# EAGLE design EIB_RHD32_HW01 (EAGLE 9.0.0)
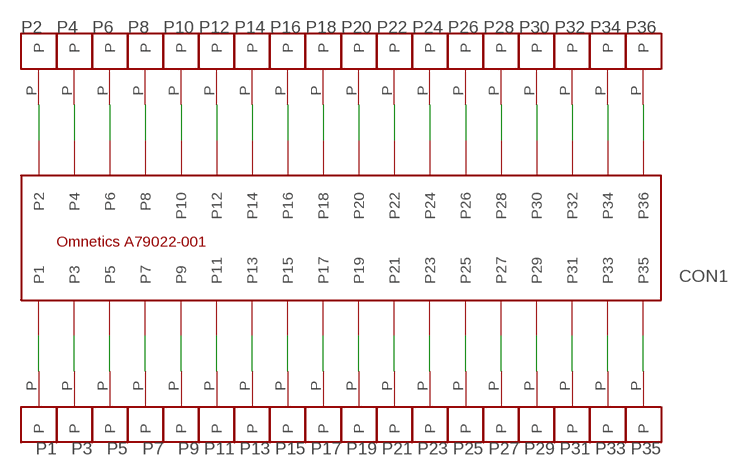
[diagram p0: schematic, sheet 1]

## Parts
CON1  A79022-001_MALESMD  [A79026-001_MALE]
P1  EIB_SMALL_PIN  [EIB_SMALL_PIN]
P2  EIB_SMALL_PIN  [EIB_SMALL_PIN]
P3  EIB_SMALL_PIN  [EIB_SMALL_PIN]
P4  EIB_SMALL_PIN  [EIB_SMALL_PIN]
P5  EIB_SMALL_PIN  [EIB_SMALL_PIN]
P6  EIB_SMALL_PIN  [EIB_SMALL_PIN]
P7  EIB_SMALL_PIN  [EIB_SMALL_PIN]
P8  EIB_SMALL_PIN  [EIB_SMALL_PIN]
P9  EIB_SMALL_PIN  [EIB_SMALL_PIN]
P10  EIB_SMALL_PIN  [EIB_SMALL_PIN]
P11  EIB_SMALL_PIN  [EIB_SMALL_PIN]
P12  EIB_SMALL_PIN  [EIB_SMALL_PIN]
P13  EIB_SMALL_PIN  [EIB_SMALL_PIN]
P14  EIB_SMALL_PIN  [EIB_SMALL_PIN]
P15  EIB_SMALL_PIN  [EIB_SMALL_PIN]
P16  EIB_SMALL_PIN  [EIB_SMALL_PIN]
P17  EIB_SMALL_PIN  [EIB_SMALL_PIN]
P18  EIB_SMALL_PIN  [EIB_SMALL_PIN]
P19  EIB_SMALL_PIN  [EIB_SMALL_PIN]
P20  EIB_SMALL_PIN  [EIB_SMALL_PIN]
P21  EIB_SMALL_PIN  [EIB_SMALL_PIN]
P22  EIB_SMALL_PIN  [EIB_SMALL_PIN]
P23  EIB_SMALL_PIN  [EIB_SMALL_PIN]
P24  EIB_SMALL_PIN  [EIB_SMALL_PIN]
P25  EIB_SMALL_PIN  [EIB_SMALL_PIN]
P26  EIB_SMALL_PIN  [EIB_SMALL_PIN]
P27  EIB_SMALL_PIN  [EIB_SMALL_PIN]
P28  EIB_SMALL_PIN  [EIB_SMALL_PIN]
P29  EIB_SMALL_PIN  [EIB_SMALL_PIN]
P30  EIB_SMALL_PIN  [EIB_SMALL_PIN]
P31  EIB_SMALL_PIN  [EIB_SMALL_PIN]
P32  EIB_SMALL_PIN  [EIB_SMALL_PIN]
P33  EIB_SMALL_PIN  [EIB_SMALL_PIN]
P34  EIB_SMALL_PIN  [EIB_SMALL_PIN]
P35  EIB_SMALL_PIN  [EIB_SMALL_PIN]
P36  EIB_SMALL_PIN  [EIB_SMALL_PIN]

## Nets
N$1: CON1.P1 P1.P
N$2: CON1.P2 P2.P
N$3: CON1.P3 P3.P
N$4: CON1.P4 P4.P
N$5: CON1.P5 P5.P
N$6: CON1.P6 P6.P
N$7: CON1.P7 P7.P
N$8: CON1.P8 P8.P
N$9: CON1.P9 P9.P
N$10: CON1.P10 P10.P
N$11: CON1.P11 P11.P
N$12: CON1.P12 P12.P
N$13: CON1.P13 P13.P
N$14: CON1.P14 P14.P
N$15: CON1.P15 P15.P
N$16: CON1.P16 P16.P
N$17: CON1.P17 P17.P
N$18: CON1.P18 P18.P
N$19: CON1.P19 P19.P
N$20: CON1.P20 P20.P
N$21: CON1.P21 P21.P
N$22: CON1.P22 P22.P
N$23: CON1.P23 P23.P
N$24: CON1.P24 P24.P
N$25: CON1.P25 P25.P
N$26: CON1.P26 P26.P
N$27: CON1.P27 P27.P
N$28: CON1.P28 P28.P
N$29: CON1.P29 P29.P
N$30: CON1.P30 P30.P
N$31: CON1.P31 P31.P
N$32: CON1.P32 P32.P
N$33: CON1.P33 P33.P
N$34: CON1.P34 P34.P
N$35: CON1.P35 P35.P
N$36: CON1.P36 P36.P

## Library data of the parts
CON1 = omnetics:A79022-001_MALE
P1-P36 = Hao_Library:EIB_SMALL_PIN

## Board
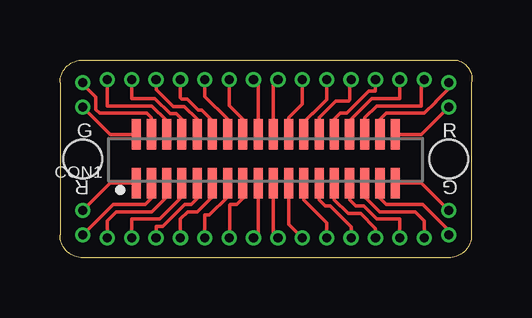
[diagram p1: board, top side]

Size 17.16 x 8.25 mm. Coordinates in mm from the lower left corner, seen from the top.
Outline: 0.95,0 arc-90 0,0.95 0,7.3 arc-90 0.95,8.25 16.51,8.25 arc-90 17.15,7.3 17.15,0.95 arc-90 16.19,0 0.95,0
Copper layers (1*16): Top 0.035559375mm / dielectric 1.6mm / Bottom 0.035559375mm
Design rules "oshpark-2layer": minimum track width 6mil, minimum drill 10mil, track to track 6mil, track to pad 6mil, pad to pad 6mil, via to via 6mil, smd to smd 6mil, copper to edge 15mil, drill to drill 6mil, minimum pad ring 5mil, minimum via ring 5mil, stop-mask expansion 2.5mil, vias tented up to drill 0mil, thermal gap 10mil
Holes 1.61 mm at 0.95,4.13 16.19,4.13

### Footprints (pad centres in the part's own frame; a part is rotated, then mirrored left to right if it is on the bottom)
A79026-001_MALE = smd 0.381 x 1.27: P1 -5.397,-1.016; P2 -5.397,1.016; P3 -4.763,-1.016; P4 -4.763,1.016; P5 -4.128,-1.016; P6 -4.128,1.016; P7 -3.493,-1.016; P8 -3.493,1.016; P9 -2.857,-1.016; P10 -2.857,1.016; P11 -2.223,-1.016; P12 -2.223,1.016; P13 -1.587,-1.016; P14 -1.587,1.016; P15 -0.953,-1.016; P16 -0.953,1.016; P17 -0.318,-1.016; P18 -0.318,1.016; P19 0.318,-1.016; P20 0.318,1.016; P21 0.953,-1.016; P22 0.953,1.016; P23 1.587,-1.016; P24 1.587,1.016; P25 2.223,-1.016; P26 2.223,1.016; P27 2.857,-1.016; P28 2.857,1.016; P29 3.493,-1.016; P30 3.493,1.016; P31 4.128,-1.016; P32 4.128,1.016; P33 4.763,-1.016; P34 4.763,1.016; P35 5.397,-1.016; P36 5.397,1.016
EIB_SMALL_PIN = drill 0.381 pad 0.635: P 0,0

### Placement (x,y rotation side)
CON1  8.57,4.13 0 top
P1  0.95,1.97 180 top
P2  0.95,6.29 180 top
P3  0.95,0.95 180 top
P4  0.95,7.3 180 top
P5  1.97,0.83 180 top
P6  1.97,7.43 180 top
P7  2.98,0.83 180 top
P8  2.98,7.43 180 top
P9  4,0.83 180 top
P10  4,7.43 180 top
P11  5.02,0.83 180 top
P12  5.02,7.43 180 top
P13  6.03,0.83 180 top
P14  6.03,7.43 180 top
P15  7.05,0.83 270 top
P16  7.05,7.43 180 top
P17  8.06,0.83 180 top
P18  8.06,7.43 180 top
P19  9.08,0.83 180 top
P20  9.08,7.43 180 top
P21  10.1,0.83 180 top
P22  10.1,7.43 180 top
P23  11.11,0.83 180 top
P24  11.11,7.43 180 top
P25  12.13,0.83 180 top
P26  12.13,7.43 180 top
P27  13.14,0.83 180 top
P28  13.14,7.43 180 top
P29  14.16,0.83 180 top
P30  14.16,7.43 180 top
P31  15.18,0.83 180 top
P32  15.18,7.43 180 top
P33  16.19,0.95 180 top
P34  16.19,7.3 180 top
P35  16.19,1.97 180 top
P36  16.19,6.29 180 top

### Tracks (layer width: path | path; a pad name or v marks a point on that pad's centre or on a via)
N$1
  Top 0.152: CON1.P1 2.1,3.11 P1.P
N$2
  Top 0.152: CON1.P2 2.1,5.14 P2.P
N$3
  Top 0.152: CON1.P3 3.81,2.48 3.56,2.22 2.22,2.22 P3.P
N$4
  Top 0.152: CON1.P4 3.81,5.84 3.62,6.03 1.65,6.03 1.5,6.18 1.5,6.69 0.95,7.24 P4.P
N$5
  Top 0.152: CON1.P5 4.44,2.54 3.82,1.92 2.35,1.92 1.97,1.54 P5.P
N$6
  Top 0.152: CON1.P6 4.44,5.71 3.82,6.34 1.97,6.34 P6.P
N$7
  Top 0.152: CON1.P7 5.08,2.54 4.15,1.61 2.98,1.61 P7.P
N$8
  Top 0.152: CON1.P8 5.08,5.78 4.85,6.01 4.58,6.01 3.95,6.64 2.98,6.64 P8.P
N$9
  Top 0.152: CON1.P9 5.72,2.48 5.46,2.22 5.19,2.22 4.28,1.31 4,1.31 P9.P
N$10
  Top 0.152: CON1.P10 5.72,5.78 5.18,6.31 4.71,6.31 4,7.02 P10.P
N$11
  Top 0.152: CON1.P11 6.35,2.54 5.73,1.92 5.32,1.92 5.02,1.61 P11.P
N$12
  Top 0.152: CON1.P12 6.35,5.71 5.91,6.16 5.77,6.16 5.31,6.62 5.08,6.62 5.02,6.68 P12.P
N$13
  Top 0.152: CON1.P13 6.98,2.54 6.22,1.78 6.03,1.78 P13.P
N$14
  Top 0.152: CON1.P14 6.98,5.78 6.03,6.73 P14.P
N$15
  Top 0.152: CON1.P15 7.62,2.6 7.68,2.54 7.37,2.22 7.1,2.22 7.07,2.2 7.07,0.85 P15.P
N$16
  Top 0.152: CON1.P16 7.62,5.78 7.05,6.35 P16.P
N$17
  Top 0.152: CON1.P17 8.25,1.02 P17.P
N$18
  Top 0.152: CON1.P18 8.25,7.24 P18.P
N$19
  Top 0.152: CON1.P19 8.89,1.02 P19.P
N$20
  Top 0.152: CON1.P20 8.89,7.24 P20.P
N$21
  Top 0.152: CON1.P21 9.53,1.4 P21.P
N$22
  Top 0.152: CON1.P22 9.53,5.84 10.1,6.41 P22.P
N$23
  Top 0.152: CON1.P23 10.16,2.41 11.11,1.46 P23.P
N$24
  Top 0.152: CON1.P24 10.16,5.66 10.51,6.01 10.53,6.01 11.11,6.59 P24.P
N$25
  Top 0.152: CON1.P25 10.8,2.41 11.05,2.16 11.25,2.16 12.13,1.28 P25.P
N$26
  Top 0.152: CON1.P26 10.8,5.84 11.49,6.54 12.03,6.54 12.08,6.59 12.08,7.38 P26.P
N$27
  Top 0.152: CON1.P27 11.43,2.41 12,1.84 12.54,1.84 13.14,1.23 P27.P
N$28
  Top 0.152: CON1.P28 11.43,5.78 11.68,6.03 11.95,6.03 12.87,6.95 13.14,6.95 P28.P
N$29
  Top 0.152: CON1.P29 12.06,2.41 12.32,2.16 12.65,2.16 13.2,1.61 14.16,1.61 P29.P
N$30
  Top 0.152: CON1.P30 12.06,5.71 12.99,6.64 14.16,6.64 P30.P
N$31
  Top 0.152: CON1.P31 12.7,2.54 13.32,1.92 14.8,1.92 15.18,1.54 P31.P
N$32
  Top 0.152: CON1.P32 12.7,5.84 13.2,6.34 15.05,6.34 15.06,6.34 15.06,7.31 P32.P
N$33
  Top 0.152: CON1.P33 13.33,2.48 13.59,2.22 15.11,2.22 16.19,1.14 P33.P
N$34
  Top 0.152: CON1.P34 13.33,5.78 13.59,6.03 15.18,6.03 15.65,6.5 15.65,6.51 15.97,6.83 15.98,6.83 16.19,7.05 P34.P
N$35
  Top 0.152: CON1.P35 15.05,3.11 P35.P
N$36
  Top 0.152: CON1.P36 15.05,5.14 P36.P

### Text on the board
tPlace: G | R | R | G